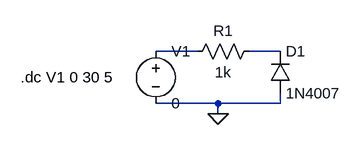
[diagram p0: schematic DIODE_REVERSE.asc]
DIODE_REVERSE.asc, the LTspice schematic file:
Version 4.1
SHEET 1 880 680
WIRE 112 128 48 128
WIRE 240 128 192 128
WIRE 144 208 48 208
WIRE 240 208 240 192
WIRE 240 208 144 208
WIRE 144 224 144 208
FLAG 144 224 0
SYMBOL voltage 48 112 R0
SYMATTR InstName V1
SYMATTR Value 0
SYMBOL diode 224 192 M180
WINDOW 0 24 64 Left 2
WINDOW 3 24 0 Left 2
SYMATTR InstName D1
SYMATTR Value 1N4007
SYMBOL res 208 112 R90
WINDOW 0 0 56 VBottom 2
WINDOW 3 32 56 VTop 2
SYMATTR InstName R1
SYMATTR Value 1k
TEXT -160 168 Left 2 !.dc V1 0 30 5

The netlist it stands for:
* DIODE_REVERSE.asc
V1 N001 0 0
D1 0 N002 1N4007
R1 N002 N001 1k
.model D D
.lib standard.dio
.dc V1 0 30 5
.backanno
.end